# EAGLE design BOTCPCB (EAGLE 9.4.2)
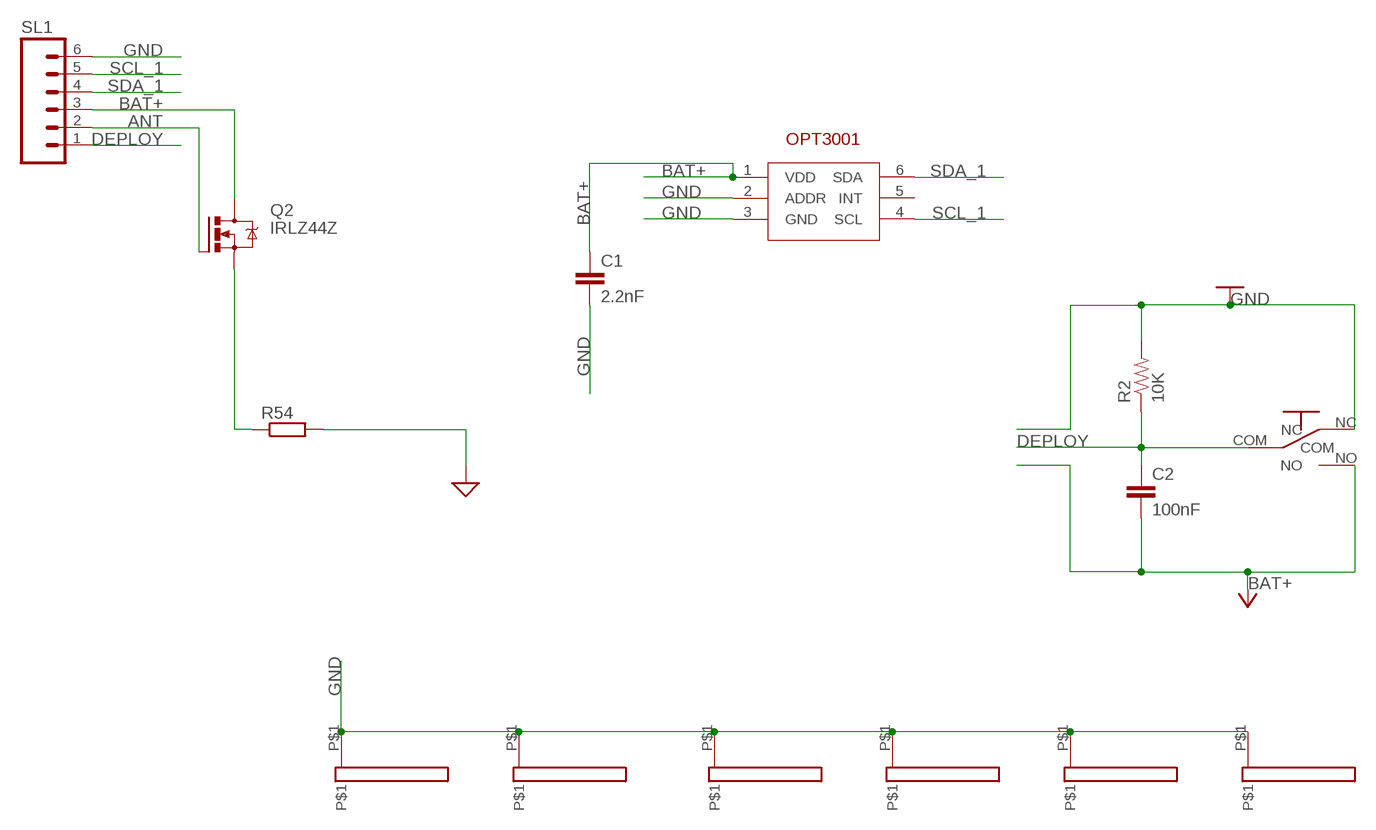
[diagram p0: schematic, sheet 1]

## Parts
C1  2.2nF  2.2NF/2200PF-0603-50V-10%  [0603]
C2  100nF  CAP0805  [0805]
Q2  IRLZ44Z  [TO220BH]
R2  10K  RESISTOR  [0805]
R54  R-EU_0204/2V  [0204V]
SL1  M06  [06P]
U1  SON65P200X200X65-7N  [SON65P200X200X65-7N]
U$1  16X2  [16X2]
U$2  16X2  [16X2]
U$4  16X2  [16X2]
U$5  16X2  [16X2]
U$6  OMRON-D2FA  [OMRON-D2F-A]
U$7  16X2  [16X2]
U$8  16X2  [16X2]

## Nets
ANT: Q2.G SL1.2
BAT+: C1.1 C2.2 Q2.D SL1.3 U1.1(VDD) U$6.NO ; supply symbol labelled VCC
DEPLOY: C2.1 R2.1 SL1.1 U$6.COM
GND [vcc]: C1.2 R2.2 R54.2 SL1.6 U1.2(ADDR) U1.3(GND) U$1.P$1 U$2.P$1 U$4.P$1 U$5.P$1 U$6.NC U$7.P$1 U$8.P$1 ; supply symbol labelled SUP
N$19: Q2.S R54.1
SCL_1: SL1.5 U1.4(SCL)
SDA_1: SL1.4 U1.6(SDA)
Unconnected: U1.5(INT)

## Library data of the parts
C1 = SparkFun-Capacitors:2.2NF/2200PF: 2.2nF/2,200pF ceramic capacitors A capacitor is a passive two-terminal electrical component used to store electrical energy temporarily in an electric field.; PROD_ID: CAP-07877
C2 = SparkFun:CAP: Capacitor Standard 0603 ceramic capacitor, and 0.1" leaded capacitor.
Q2 = transistor-power:IRLZ44Z: N-Channel HEXFET® Power MOSFET Logic Level AUTOMOTIVE MOSFET Source: http://www.irf.com/product-info/datasheets/data/irlz44zpbf.pdf
R2 = SparkFun:RESISTOR: Resistor Basic schematic elements and footprints for 0603, 1206, and PTH 1/10th watt (small) resistors.
R54 = rcl:R-EU_: RESISTOR, European symbol; SPICEPREFIX: R
SL1 = con-amp-quick:M06: AMP QUICK CONNECTOR; OC_FARNELL: unknown; OC_NEWARK: unknown
U1 = SON65P200X200X65-7N:SON65P200X200X65-7N; A_MAX: 0.65; B_MAX: 0.3; B_MIN: 0.2; B_NOM: 0.25; D2_NOM: 1.35; D_MAX: 2.075; D_MIN: 1.925; D_NOM: 2.0; E2_NOM: 0.65; ENOM: 0.65; E_MAX: 2.075; E_MIN: 1.925; E_NOM: 2.0; L_MAX: 0.35; L_MIN: 0.25; L_NOM: 0.3; MANUFACTURER: Maxim Integrated; PIN_COUNT: 6.0; SNAPEDA_PACKAGE_ID: 71138; STANDARD: IPC 7351B
U$1 U$2 U$4 U$5 U$7 U$8 = 16x2PAD:16X2: Pad for 90 degree solder
U$6 = reprap:OMRON-D2F

## Net classes
1 vcc: width 0.254 mm

## Board
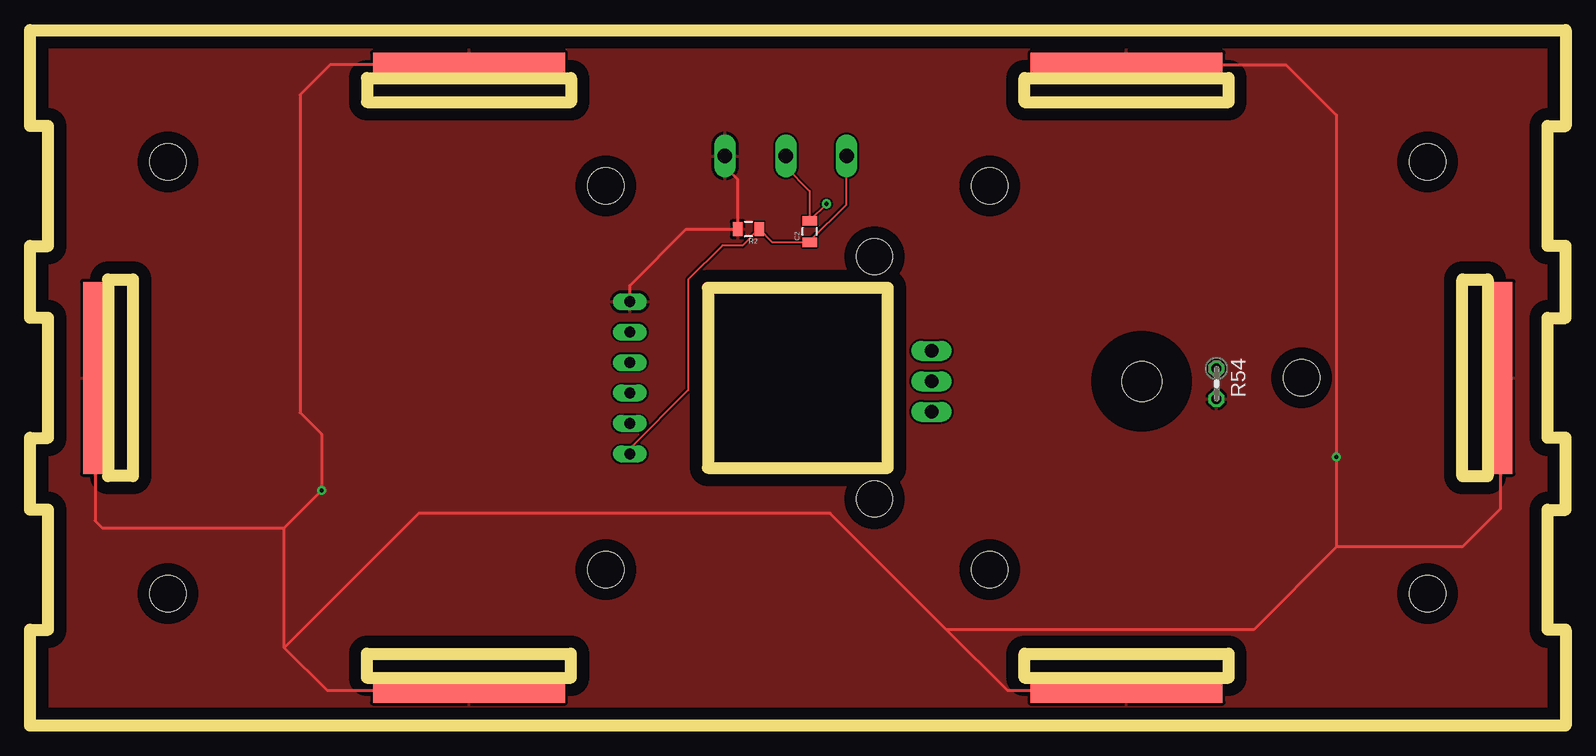
[diagram p1: board, top side]
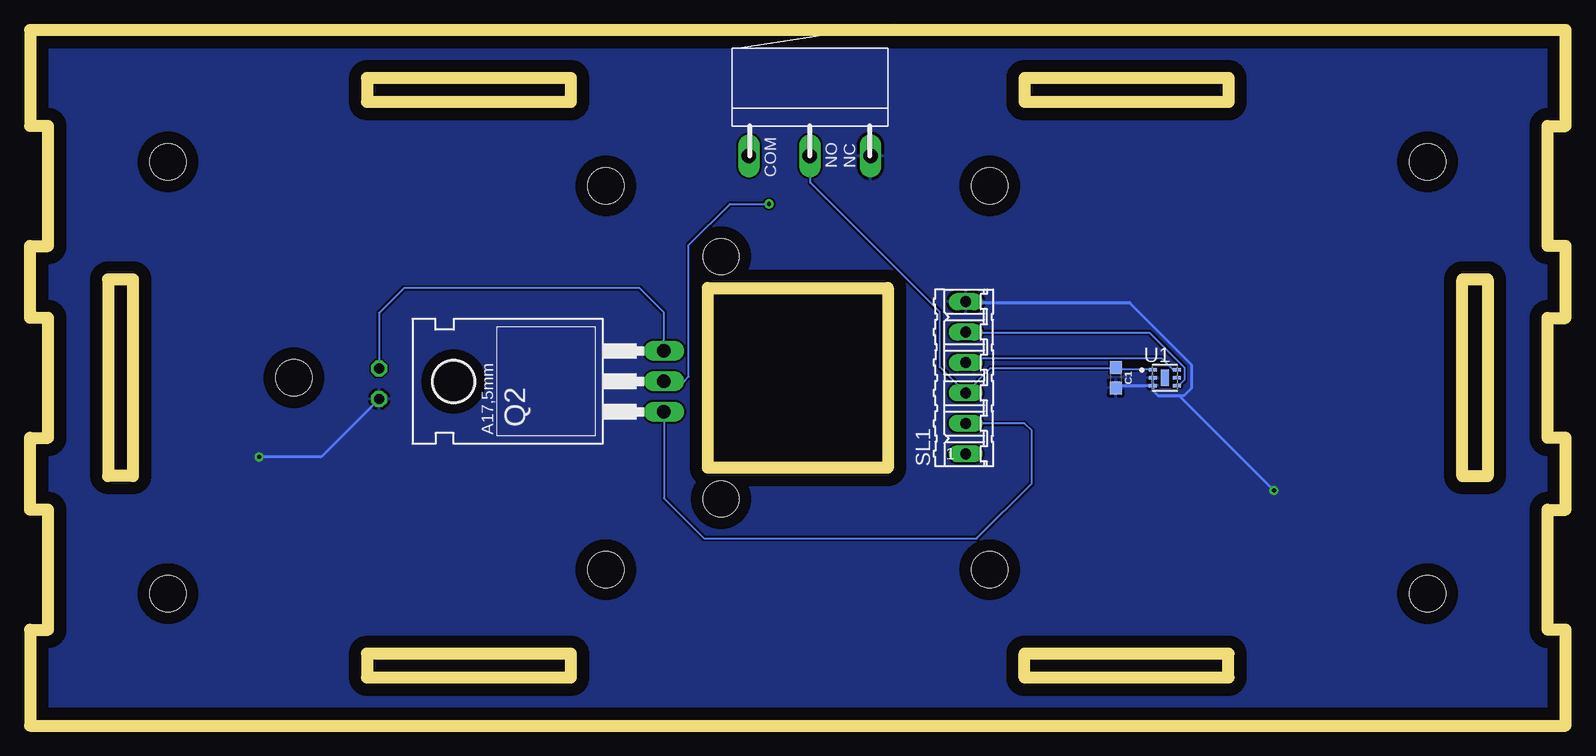
[diagram p2: board, bottom side, seen from below]

Size 128 x 58 mm. Coordinates in mm from the lower left corner, seen from the top.
Outline: 0,0 0,8 1.5,8 1.5,18 0,18 0,24 1.5,24 1.5,34 0,34 0,40 1.5,40 1.5,50 0,50 0,58 128,58 128,50 126.5,50 126.5,40 128,40 128,34 126.5,34 126.5,24 128,24 128,18 126.5,18 126.5,8 128,8 128,0 0,0
Outline: 8.6,20.8 8.6,37.2 6.5,37.2 6.5,20.8 8.6,20.8
Outline: 119.4,20.8 119.4,37.2 121.5,37.2 121.5,20.8 119.4,20.8
Outline: 28.1,52 45.1,52 45.1,54 28.1,54 28.1,52
Outline: 82.9,52 99.9,52 99.9,54 82.9,54 82.9,52
Outline: 28.1,6 45.1,6 45.1,4 28.1,4 28.1,6
Outline: 82.9,6 99.9,6 99.9,4 82.9,4 82.9,6
Outline: 71.5,36.5 56.5,36.5 56.5,21.5 71.5,21.5 71.5,36.5
Copper layers (1*16): Top 0.035mm / dielectric 1.5mm / Bottom 0.035mm
Design rules "default": minimum track width 6mil, minimum drill 0.35mm, track to track 6mil, track to pad 6mil, pad to pad 6mil, via to via 6mil, smd to smd 6mil, copper to edge 40mil, drill to drill 6mil, minimum pad ring 10mil, minimum via ring 8mil, stop-mask expansion 4mil, vias tented up to drill 0mil, thermal gap 10mil
Holes 3 mm at 11.5,47 11.5,11 116.5,11 116.5,47 70.4,39.1 70.4,18.9 48,45 80,45 48,13 80,13 106,29

### Footprints (pad centres in the part's own frame; a part is rotated, then mirrored left to right if it is on the bottom)
0603 = smd 1.1 x 1: 1 -0.85,0; 2 0.85,0
0805 = smd 0.8 x 1.2: 1 -0.9,0; 2 0.9,0
TO220BH = drill 1.118 long: D 0,-6.35; G -2.54,-6.35; S 2.54,-6.35 | hole 3.302: 0,11.176
0204V = drill 0.813 octagon: 1 -1.27,0; 2 1.27,0
06P = drill 0.914 long: 1 -6.35,0; 2 -3.81,0; 3 -1.27,0; 4 1.27,0; 5 3.81,0; 6 6.35,0
SON65P200X200X65-7N = smd 0.72 x 0.27: 1 -0.995,0.65; 2 -0.995,0; 3 -0.995,-0.65; 4 0.995,-0.65; 5 0.995,0; 6 0.995,0.65 | smd 0.65 x 1.35: 7 0,0
16X2 = smd 16 x 2: P$1 0,0
OMRON-D2F-A = drill 1.2 long: COM -5.08,0; NC 5.08,0; NO 0,0

### Placement (x,y rotation side)
C1  37.5,29 270 bottom
C2  65,41.2 90 top
Q2  81.5,28.7 90 bottom
R2  59.9,41.4 180 top
R54  98.9,28.5 270 top
SL1  50,29 90 bottom
U1  33.4,29 0 bottom
U$1  122.57,28.99 270 top
U$2  5.43,28.99 270 top
U$4  36.6,2.9 0 top
U$5  36.6,55.1 0 top
U$6  63,47.5 0 bottom
U$7  91.4,2.9 0 top
U$8  91.4,55.1 0 top

### Tracks (layer width: path | path; a pad name or v marks a point on that pad's centre or on a via)
ANT
  Bottom 0.152: Q2.G 75.15,18.95 71.8,15.6 49.1,15.6 44.5,20.2 44.5,24.6 45.1,25.2 SL1.2
BAT+  (via drill 0.35)
  Top 0.152: 65,42.14 65,44.58 63.02,46.56 U$6.NO | 65,42.14 C2.2 | v66.4,43.5 65.04,42.14 65,42.14
  Bottom 0.152: U1.1 34.44,29.72 37.41,29.72 37.49,29.79 C1.1 37.57,29.79 47.93,29.79 49.99,27.74 SL1.3 | SL1.3 52.16,29.89 52.16,34.48 62.94,45.26 62.94,46.56 U$6.NO | SL1.3 | Q2.D 73.49,28.7 73.09,29.1 73.09,40.07 69.67,43.5 v66.4,43.5
DEPLOY
  Top 0.152: SL1.1 50.06,22.71 50.06,23.16 54.86,27.96 54.86,37.19 57.72,40.04 59.39,40.04 60.73,41.38 R2.1 60.81,41.38 61.87,40.31 C2.1 65,40.39 68.05,43.43 68.05,46.56 U$6.COM
GND  (via drill 0.35)
  Top 0.254: U$6.NC 57.99,46.56 58.98,45.57 58.98,41.45 R2.2 58.9,41.38 54.68,41.38 50,36.69 SL1.6 | U$4.P$1 24.8,2.9 21.2,6.5 | 21.2,6.5 21.2,16.5 | 21.2,16.5 v24.3,19.6 24.3,24.3 22.5,26.1 22.5,52.6 25,55.1 U$5.P$1 | U$2.P$1 5.43,17.07 6,16.5 21.2,16.5 | U$8.P$1 104.7,55.1 108.9,50.9 v108.9,22.4 108.9,14.9 | 108.9,14.9 102,8 76.4,8 | 21.2,6.5 32.4,17.7 66.7,17.7 76.4,8 | U$7.P$1 81.5,2.9 76.4,8 | U$1.P$1 122.57,18.07 119.4,14.9 108.9,14.9
  Bottom 0.254: U1.3 34.44,28.42 34.44,28.96 U1.2 | U1.3 34.52,28.35 37.34,28.35 37.49,28.19 C1.2 | U1.3 34.4,27.93 33.96,27.49 32.19,27.49 | 32.19,27.49 31.83,27.49 31.19,28.12 31.19,30.12 36.35,35.28 49.99,35.28 SL1.6 | v24.3,19.6 32.19,27.49 | R54.2 103.73,22.4 v108.9,22.4
  pour Top: 1.5,0 1.5,58 126.5,58 126.5,0
  pour Bottom: 1.5,0 1.5,58 126.5,58 126.5,0
N$19
  Bottom 0.152: Q2.S 75.15,34.45 77.2,36.5 96.8,36.5 98.9,34.4 R54.1
SCL_1
  Bottom 0.152: U1.4 32.38,28.42 32.16,28.42 31.77,28.8 31.77,29.87 34.67,32.77 49.99,32.77 SL1.5
SDA_1
  Bottom 0.152: SL1.4 49.34,30.27 48.98,30.63 33.68,30.63 32.77,29.72 32.46,29.72 U1.6